# EAGLE schematic NeoKey 5x6 Ortho Snap-Apart (EAGLE 9.6.2)
COMPANY: ADAFRUIT INDUSTRIES; DRAWN: KTOWN; REV: A
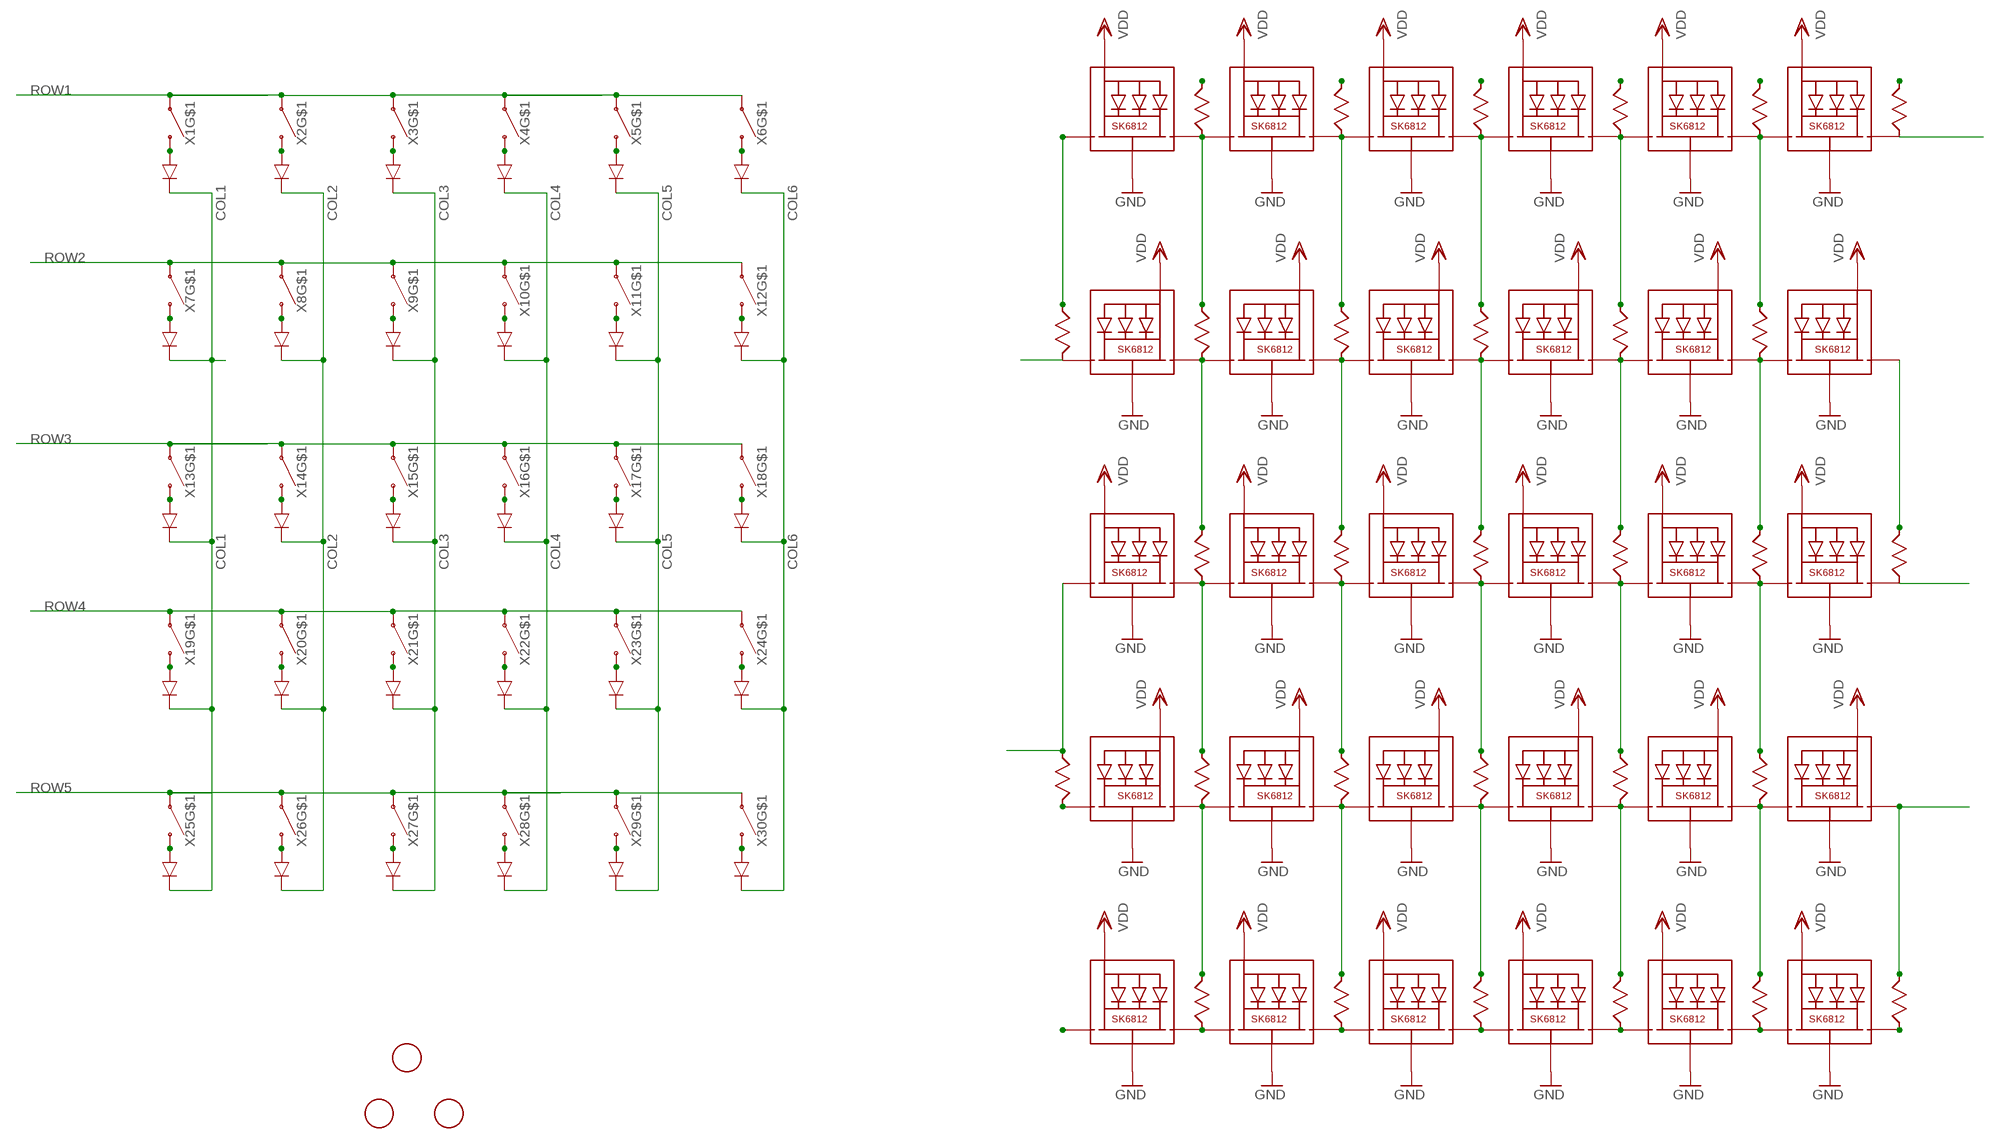
[diagram p0: schematic, sheet 1]

## Parts
U$1  FIDUCIAL  [FIDUCIAL_1MM]
U$2  FIDUCIAL  [FIDUCIAL_1MM]
U$3  FIDUCIAL  [FIDUCIAL_1MM]
X1  KAILH_SOCKET_TILE  [KAILH_SOCKET_TILE]
X2  KAILH_SOCKET_TILE  [KAILH_SOCKET_TILE]
X3  KAILH_SOCKET_TILE  [KAILH_SOCKET_TILE]
X4  KAILH_SOCKET_TILE  [KAILH_SOCKET_TILE]
X5  KAILH_SOCKET_TILE  [KAILH_SOCKET_TILE]
X6  KAILH_SOCKET_TILE  [KAILH_SOCKET_TILE]
X7  KAILH_SOCKET_TILE_REVERSE  [KAILH_SOCKET_TILE_REV]
X8  KAILH_SOCKET_TILE_REVERSE  [KAILH_SOCKET_TILE_REV]
X9  KAILH_SOCKET_TILE_REVERSE  [KAILH_SOCKET_TILE_REV]
X10  KAILH_SOCKET_TILE_REVERSE  [KAILH_SOCKET_TILE_REV]
X11  KAILH_SOCKET_TILE_REVERSE  [KAILH_SOCKET_TILE_REV]
X12  KAILH_SOCKET_TILE_REVERSE  [KAILH_SOCKET_TILE_REV]
X13  KAILH_SOCKET_TILE  [KAILH_SOCKET_TILE]
X14  KAILH_SOCKET_TILE  [KAILH_SOCKET_TILE]
X15  KAILH_SOCKET_TILE  [KAILH_SOCKET_TILE]
X16  KAILH_SOCKET_TILE  [KAILH_SOCKET_TILE]
X17  KAILH_SOCKET_TILE  [KAILH_SOCKET_TILE]
X18  KAILH_SOCKET_TILE  [KAILH_SOCKET_TILE]
X19  KAILH_SOCKET_TILE_REVERSE  [KAILH_SOCKET_TILE_REV]
X20  KAILH_SOCKET_TILE_REVERSE  [KAILH_SOCKET_TILE_REV]
X21  KAILH_SOCKET_TILE_REVERSE  [KAILH_SOCKET_TILE_REV]
X22  KAILH_SOCKET_TILE_REVERSE  [KAILH_SOCKET_TILE_REV]
X23  KAILH_SOCKET_TILE_REVERSE  [KAILH_SOCKET_TILE_REV]
X24  KAILH_SOCKET_TILE_REVERSE  [KAILH_SOCKET_TILE_REV]
X25  KAILH_SOCKET_TILE  [KAILH_SOCKET_TILE]
X26  KAILH_SOCKET_TILE  [KAILH_SOCKET_TILE]
X27  KAILH_SOCKET_TILE  [KAILH_SOCKET_TILE]
X28  KAILH_SOCKET_TILE  [KAILH_SOCKET_TILE]
X29  KAILH_SOCKET_TILE  [KAILH_SOCKET_TILE]
X30  KAILH_SOCKET_TILE  [KAILH_SOCKET_TILE]

## Nets
COL1: X1.C1(SW_C) X1.C2(SW_C) X1.C(SW_C) X7.C1(SW_C) X7.C2(SW_C) X7.C(SW_C) X13.C1(SW_C) X13.C2(SW_C) X13.C(SW_C) X19.C1(SW_C) X19.C2(SW_C) X19.C(SW_C) X25.C1(SW_C) X25.C2(SW_C) X25.C(SW_C)
COL2: X2.C1(SW_C) X2.C2(SW_C) X2.C(SW_C) X8.C1(SW_C) X8.C2(SW_C) X8.C(SW_C) X14.C1(SW_C) X14.C2(SW_C) X14.C(SW_C) X20.C1(SW_C) X20.C2(SW_C) X20.C(SW_C) X26.C1(SW_C) X26.C2(SW_C) X26.C(SW_C)
COL3: X3.C1(SW_C) X3.C2(SW_C) X3.C(SW_C) X9.C1(SW_C) X9.C2(SW_C) X9.C(SW_C) X15.C1(SW_C) X15.C2(SW_C) X15.C(SW_C) X21.C1(SW_C) X21.C2(SW_C) X21.C(SW_C) X27.C1(SW_C) X27.C2(SW_C) X27.C(SW_C)
COL4: X4.C1(SW_C) X4.C2(SW_C) X4.C(SW_C) X10.C1(SW_C) X10.C2(SW_C) X10.C(SW_C) X16.C1(SW_C) X16.C2(SW_C) X16.C(SW_C) X22.C1(SW_C) X22.C2(SW_C) X22.C(SW_C) X28.C1(SW_C) X28.C2(SW_C) X28.C(SW_C)
COL5: X5.C1(SW_C) X5.C2(SW_C) X5.C(SW_C) X11.C1(SW_C) X11.C2(SW_C) X11.C(SW_C) X17.C1(SW_C) X17.C2(SW_C) X17.C(SW_C) X23.C1(SW_C) X23.C2(SW_C) X23.C(SW_C) X29.C1(SW_C) X29.C2(SW_C) X29.C(SW_C)
COL6: X6.C1(SW_C) X6.C2(SW_C) X6.C(SW_C) X12.C1(SW_C) X12.C2(SW_C) X12.C(SW_C) X18.C1(SW_C) X18.C2(SW_C) X18.C(SW_C) X24.C1(SW_C) X24.C2(SW_C) X24.C(SW_C) X30.C1(SW_C) X30.C2(SW_C) X30.C(SW_C)
GND: X1.3-GND(GND) X1.C-(GND) X1.GND1(GND) X1.GND2(GND) X2.3-GND(GND) X2.C-(GND) X2.GND1(GND) X2.GND2(GND) X3.3-GND(GND) X3.C-(GND) X3.GND1(GND) X3.GND2(GND) X4.3-GND(GND) X4.C-(GND) X4.GND1(GND) X4.GND2(GND) X5.3-GND(GND) X5.C-(GND) X5.GND1(GND) X5.GND2(GND) X6.3-GND(GND) X6.C-(GND) X6.GND1(GND) X6.GND2(GND) X7.3-GND(GND) X7.C-(GND) X7.GND1(GND) X7.GND2(GND) X8.3-GND(GND) X8.C-(GND) X8.GND1(GND) X8.GND2(GND) X9.3-GND(GND) X9.C-(GND) X9.GND1(GND) X9.GND2(GND) X10.3-GND(GND) X10.C-(GND) X10.GND1(GND) X10.GND2(GND) X11.3-GND(GND) X11.C-(GND) X11.GND1(GND) X11.GND2(GND) X12.3-GND(GND) X12.C-(GND) X12.GND1(GND) X12.GND2(GND) X13.3-GND(GND) X13.C-(GND) X13.GND1(GND) X13.GND2(GND) X14.3-GND(GND) X14.C-(GND) X14.GND1(GND) X14.GND2(GND) X15.3-GND(GND) X15.C-(GND) X15.GND1(GND) X15.GND2(GND) X16.3-GND(GND) X16.C-(GND) X16.GND1(GND) X16.GND2(GND) X17.3-GND(GND) X17.C-(GND) X17.GND1(GND) X17.GND2(GND) X18.3-GND(GND) X18.C-(GND) X18.GND1(GND) X18.GND2(GND) X19.3-GND(GND) X19.C-(GND) X19.GND1(GND) X19.GND2(GND) X20.3-GND(GND) X20.C-(GND) X20.GND1(GND) X20.GND2(GND) X21.3-GND(GND) X21.C-(GND) X21.GND1(GND) X21.GND2(GND) X22.3-GND(GND) X22.C-(GND) X22.GND1(GND) X22.GND2(GND) X23.3-GND(GND) X23.C-(GND) X23.GND1(GND) X23.GND2(GND) X24.3-GND(GND) X24.C-(GND) X24.GND1(GND) X24.GND2(GND) X25.3-GND(GND) X25.C-(GND) X25.GND1(GND) X25.GND2(GND) X26.3-GND(GND) X26.C-(GND) X26.GND1(GND) X26.GND2(GND) X27.3-GND(GND) X27.C-(GND) X27.GND1(GND) X27.GND2(GND) X28.3-GND(GND) X28.C-(GND) X28.GND1(GND) X28.GND2(GND) X29.3-GND(GND) X29.C-(GND) X29.GND1(GND) X29.GND2(GND) X30.3-GND(GND) X30.C-(GND) X30.GND1(GND) X30.GND2(GND)
N$1: X1.4-DIN(DI) X1.DIN1(DI) X1.DIN(DI) X2.2-DOUT(DO) X2.DOUT1(DO) X2.DOUT(DO) X8.DIN_C1(DI1) X8.DIN_C(DI1)
N$2: X1.D+(DA) X1.DA
N$3: X1.DIN_C1(DI1) X1.DIN_C(DI1)
N$4: X2.D+(DA) X2.DA
N$5: X4.D+(DA) X4.DA
N$6: X1.2-DOUT(DO) X1.DOUT1(DO) X1.DOUT(DO) X7.DIN_C1(DI1) X7.DIN_C(DI1)
N$7: X7.D+(DA) X7.DA
N$8: X2.DIN_C1(DI1) X2.DIN_C(DI1)
N$9: X3.D+(DA) X3.DA
N$10: X2.4-DIN(DI) X2.DIN1(DI) X2.DIN(DI) X3.2-DOUT(DO) X3.DOUT1(DO) X3.DOUT(DO) X9.DIN_C1(DI1) X9.DIN_C(DI1)
N$11: X3.4-DIN(DI) X3.DIN1(DI) X3.DIN(DI) X4.2-DOUT(DO) X4.DOUT1(DO) X4.DOUT(DO) X10.DIN_C1(DI1) X10.DIN_C(DI1)
N$12: X3.DIN_C1(DI1) X3.DIN_C(DI1)
N$13: X4.4-DIN(DI) X4.DIN1(DI) X4.DIN(DI) X5.2-DOUT(DO) X5.DOUT1(DO) X5.DOUT(DO) X11.DIN_C1(DI1) X11.DIN_C(DI1)
N$14: X4.DIN_C1(DI1) X4.DIN_C(DI1)
N$15: X6.D+(DA) X6.DA
N$16: X5.4-DIN(DI) X5.DIN1(DI) X5.DIN(DI) X6.2-DOUT(DO) X6.DOUT1(DO) X6.DOUT(DO) X12.DIN_C1(DI1) X12.DIN_C(DI1)
N$17: X12.2-DOUT(DO) X12.DOUT1(DO) X12.DOUT(DO) X18.DIN_C1(DI1) X18.DIN_C(DI1)
N$18: X6.DIN_C1(DI1) X6.DIN_C(DI1)
N$19: X5.D+(DA) X5.DA
N$20: X5.DIN_C1(DI1) X5.DIN_C(DI1)
N$21: X6.4-DIN(DI) X6.DIN1(DI) X6.DIN(DI)
N$23: X13.D+(DA) X13.DA
N$24: X8.D+(DA) X8.DA
N$25: X8.2-DOUT(DO) X8.DOUT1(DO) X8.DOUT(DO) X9.4-DIN(DI) X9.DIN1(DI) X9.DIN(DI) X14.DIN_C1(DI1) X14.DIN_C(DI1)
N$26: X13.2-DOUT(DO) X13.DOUT1(DO) X13.DOUT(DO) X19.DIN_C1(DI1) X19.DIN_C(DI1)
N$27: X9.D+(DA) X9.DA
N$28: X9.2-DOUT(DO) X9.DOUT1(DO) X9.DOUT(DO) X10.4-DIN(DI) X10.DIN1(DI) X10.DIN(DI) X15.DIN_C1(DI1) X15.DIN_C(DI1)
N$29: X13.4-DIN(DI) X13.DIN1(DI) X13.DIN(DI) X14.2-DOUT(DO) X14.DOUT1(DO) X14.DOUT(DO) X20.DIN_C1(DI1) X20.DIN_C(DI1)
N$30: X10.D+(DA) X10.DA
N$31: X10.2-DOUT(DO) X10.DOUT1(DO) X10.DOUT(DO) X11.4-DIN(DI) X11.DIN1(DI) X11.DIN(DI) X16.DIN_C1(DI1) X16.DIN_C(DI1)
N$32: X7.2-DOUT(DO) X7.DOUT1(DO) X7.DOUT(DO) X8.4-DIN(DI) X8.DIN1(DI) X8.DIN(DI) X13.DIN_C1(DI1) X13.DIN_C(DI1)
N$33: X11.D+(DA) X11.DA
N$34: X11.2-DOUT(DO) X11.DOUT1(DO) X11.DOUT(DO) X12.4-DIN(DI) X12.DIN1(DI) X12.DIN(DI) X17.DIN_C1(DI1) X17.DIN_C(DI1)
N$35: X15.D+(DA) X15.DA
N$36: X12.D+(DA) X12.DA
N$37: X14.4-DIN(DI) X14.DIN1(DI) X14.DIN(DI) X15.2-DOUT(DO) X15.DOUT1(DO) X15.DOUT(DO) X21.DIN_C1(DI1) X21.DIN_C(DI1)
N$38: X7.4-DIN(DI) X7.DIN1(DI) X7.DIN(DI)
N$39: X14.D+(DA) X14.DA
N$40: X25.D+(DA) X25.DA
N$41: X16.D+(DA) X16.DA
N$42: X16.4-DIN(DI) X16.DIN1(DI) X16.DIN(DI) X17.2-DOUT(DO) X17.DOUT1(DO) X17.DOUT(DO) X23.DIN_C1(DI1) X23.DIN_C(DI1)
N$43: X25.2-DOUT(DO) X25.DOUT1(DO) X25.DOUT(DO)
N$44: X18.D+(DA) X18.DA
N$45: X17.4-DIN(DI) X17.DIN1(DI) X17.DIN(DI) X18.2-DOUT(DO) X18.DOUT1(DO) X18.DOUT(DO) X24.DIN_C1(DI1) X24.DIN_C(DI1)
N$46: X18.4-DIN(DI) X18.DIN1(DI) X18.DIN(DI)
N$47: X25.4-DIN(DI) X25.DIN1(DI) X25.DIN(DI) X26.2-DOUT(DO) X26.DOUT1(DO) X26.DOUT(DO)
N$48: X17.D+(DA) X17.DA
N$50: X15.4-DIN(DI) X15.DIN1(DI) X15.DIN(DI) X16.2-DOUT(DO) X16.DOUT1(DO) X16.DOUT(DO) X22.DIN_C1(DI1) X22.DIN_C(DI1)
N$51: X19.D+(DA) X19.DA
N$52: X19.2-DOUT(DO) X19.DOUT1(DO) X19.DOUT(DO) X20.4-DIN(DI) X20.DIN1(DI) X20.DIN(DI) X25.DIN_C1(DI1) X25.DIN_C(DI1)
N$53: X19.4-DIN(DI) X19.DIN1(DI) X19.DIN(DI)
N$54: X20.D+(DA) X20.DA
N$55: X20.2-DOUT(DO) X20.DOUT1(DO) X20.DOUT(DO) X21.4-DIN(DI) X21.DIN1(DI) X21.DIN(DI) X26.DIN_C1(DI1) X26.DIN_C(DI1)
N$56: X21.D+(DA) X21.DA
N$58: X22.D+(DA) X22.DA
N$59: X22.2-DOUT(DO) X22.DOUT1(DO) X22.DOUT(DO) X23.4-DIN(DI) X23.DIN1(DI) X23.DIN(DI) X28.DIN_C1(DI1) X28.DIN_C(DI1)
N$60: X23.D+(DA) X23.DA
N$61: X23.2-DOUT(DO) X23.DOUT1(DO) X23.DOUT(DO) X24.4-DIN(DI) X24.DIN1(DI) X24.DIN(DI) X29.DIN_C1(DI1) X29.DIN_C(DI1)
N$62: X24.D+(DA) X24.DA
N$63: X27.D+(DA) X27.DA
N$64: X26.4-DIN(DI) X26.DIN1(DI) X26.DIN(DI) X27.2-DOUT(DO) X27.DOUT1(DO) X27.DOUT(DO)
N$65: X21.2-DOUT(DO) X21.DOUT1(DO) X21.DOUT(DO) X22.4-DIN(DI) X22.DIN1(DI) X22.DIN(DI) X27.DIN_C1(DI1) X27.DIN_C(DI1)
N$66: X26.D+(DA) X26.DA
N$68: X28.D+(DA) X28.DA
N$69: X28.4-DIN(DI) X28.DIN1(DI) X28.DIN(DI) X29.2-DOUT(DO) X29.DOUT1(DO) X29.DOUT(DO)
N$71: X30.D+(DA) X30.DA
N$72: X29.4-DIN(DI) X29.DIN1(DI) X29.DIN(DI) X30.2-DOUT(DO) X30.DOUT1(DO) X30.DOUT(DO)
N$73: X30.4-DIN(DI) X30.DIN1(DI) X30.DIN(DI)
N$74: X24.2-DOUT(DO) X24.DOUT1(DO) X24.DOUT(DO) X30.DIN_C1(DI1) X30.DIN_C(DI1)
N$75: X29.D+(DA) X29.DA
N$77: X27.4-DIN(DI) X27.DIN1(DI) X27.DIN(DI) X28.2-DOUT(DO) X28.DOUT1(DO) X28.DOUT(DO)
ROW1: X1.A1(SW_A) X1.A2(SW_A) X1.A(SW_A) X2.A1(SW_A) X2.A2(SW_A) X2.A(SW_A) X3.A1(SW_A) X3.A2(SW_A) X3.A(SW_A) X4.A1(SW_A) X4.A2(SW_A) X4.A(SW_A) X5.A1(SW_A) X5.A2(SW_A) X5.A(SW_A) X6.A1(SW_A) X6.A2(SW_A) X6.A(SW_A)
ROW2: X7.A1(SW_A) X7.A2(SW_A) X7.A(SW_A) X8.A1(SW_A) X8.A2(SW_A) X8.A(SW_A) X9.A1(SW_A) X9.A2(SW_A) X9.A(SW_A) X10.A1(SW_A) X10.A2(SW_A) X10.A(SW_A) X11.A1(SW_A) X11.A2(SW_A) X11.A(SW_A) X12.A1(SW_A) X12.A2(SW_A) X12.A(SW_A)
ROW3: X13.A1(SW_A) X13.A2(SW_A) X13.A(SW_A) X14.A1(SW_A) X14.A2(SW_A) X14.A(SW_A) X15.A1(SW_A) X15.A2(SW_A) X15.A(SW_A) X16.A1(SW_A) X16.A2(SW_A) X16.A(SW_A) X17.A1(SW_A) X17.A2(SW_A) X17.A(SW_A) X18.A1(SW_A) X18.A2(SW_A) X18.A(SW_A)
ROW4: X19.A1(SW_A) X19.A2(SW_A) X19.A(SW_A) X20.A1(SW_A) X20.A2(SW_A) X20.A(SW_A) X21.A1(SW_A) X21.A2(SW_A) X21.A(SW_A) X22.A1(SW_A) X22.A2(SW_A) X22.A(SW_A) X23.A1(SW_A) X23.A2(SW_A) X23.A(SW_A) X24.A1(SW_A) X24.A2(SW_A) X24.A(SW_A)
ROW5: X25.A1(SW_A) X25.A2(SW_A) X25.A(SW_A) X26.A1(SW_A) X26.A2(SW_A) X26.A(SW_A) X27.A1(SW_A) X27.A2(SW_A) X27.A(SW_A) X28.A1(SW_A) X28.A2(SW_A) X28.A(SW_A) X29.A1(SW_A) X29.A2(SW_A) X29.A(SW_A) X30.A1(SW_A) X30.A2(SW_A) X30.A(SW_A)
VDD: X1.1-VDD(VDD) X1.C+(VDD) X1.VDD1(VDD) X1.VDD2(VDD) X2.1-VDD(VDD) X2.C+(VDD) X2.VDD1(VDD) X2.VDD2(VDD) X3.1-VDD(VDD) X3.C+(VDD) X3.VDD1(VDD) X3.VDD2(VDD) X4.1-VDD(VDD) X4.C+(VDD) X4.VDD1(VDD) X4.VDD2(VDD) X5.1-VDD(VDD) X5.C+(VDD) X5.VDD1(VDD) X5.VDD2(VDD) X6.1-VDD(VDD) X6.C+(VDD) X6.VDD1(VDD) X6.VDD2(VDD) X7.1-VDD(VDD) X7.C+(VDD) X7.VDD1(VDD) X7.VDD2(VDD) X8.1-VDD(VDD) X8.C+(VDD) X8.VDD1(VDD) X8.VDD2(VDD) X9.1-VDD(VDD) X9.C+(VDD) X9.VDD1(VDD) X9.VDD2(VDD) X10.1-VDD(VDD) X10.C+(VDD) X10.VDD1(VDD) X10.VDD2(VDD) X11.1-VDD(VDD) X11.C+(VDD) X11.VDD1(VDD) X11.VDD2(VDD) X12.1-VDD(VDD) X12.C+(VDD) X12.VDD1(VDD) X12.VDD2(VDD) X13.1-VDD(VDD) X13.C+(VDD) X13.VDD1(VDD) X13.VDD2(VDD) X14.1-VDD(VDD) X14.C+(VDD) X14.VDD1(VDD) X14.VDD2(VDD) X15.1-VDD(VDD) X15.C+(VDD) X15.VDD1(VDD) X15.VDD2(VDD) X16.1-VDD(VDD) X16.C+(VDD) X16.VDD1(VDD) X16.VDD2(VDD) X17.1-VDD(VDD) X17.C+(VDD) X17.VDD1(VDD) X17.VDD2(VDD) X18.1-VDD(VDD) X18.C+(VDD) X18.VDD1(VDD) X18.VDD2(VDD) X19.1-VDD(VDD) X19.C+(VDD) X19.VDD1(VDD) X19.VDD2(VDD) X20.1-VDD(VDD) X20.C+(VDD) X20.VDD1(VDD) X20.VDD2(VDD) X21.1-VDD(VDD) X21.C+(VDD) X21.VDD1(VDD) X21.VDD2(VDD) X22.1-VDD(VDD) X22.C+(VDD) X22.VDD1(VDD) X22.VDD2(VDD) X23.1-VDD(VDD) X23.C+(VDD) X23.VDD1(VDD) X23.VDD2(VDD) X24.1-VDD(VDD) X24.C+(VDD) X24.VDD1(VDD) X24.VDD2(VDD) X25.1-VDD(VDD) X25.C+(VDD) X25.VDD1(VDD) X25.VDD2(VDD) X26.1-VDD(VDD) X26.C+(VDD) X26.VDD1(VDD) X26.VDD2(VDD) X27.1-VDD(VDD) X27.C+(VDD) X27.VDD1(VDD) X27.VDD2(VDD) X28.1-VDD(VDD) X28.C+(VDD) X28.VDD1(VDD) X28.VDD2(VDD) X29.1-VDD(VDD) X29.C+(VDD) X29.VDD1(VDD) X29.VDD2(VDD) X30.1-VDD(VDD) X30.C+(VDD) X30.VDD1(VDD) X30.VDD2(VDD)

## Library data of the parts
U$1-U$3 = adafruit:FIDUCIAL: For use by pick and place machines to calibrate the vision/machine, 1mm By microbuilder.eu
X1-X30 = adafruit_electromech:KAILH_SOCKET_TILE